# EAGLE schematic Power_Input (EAGLE 9.6.2)
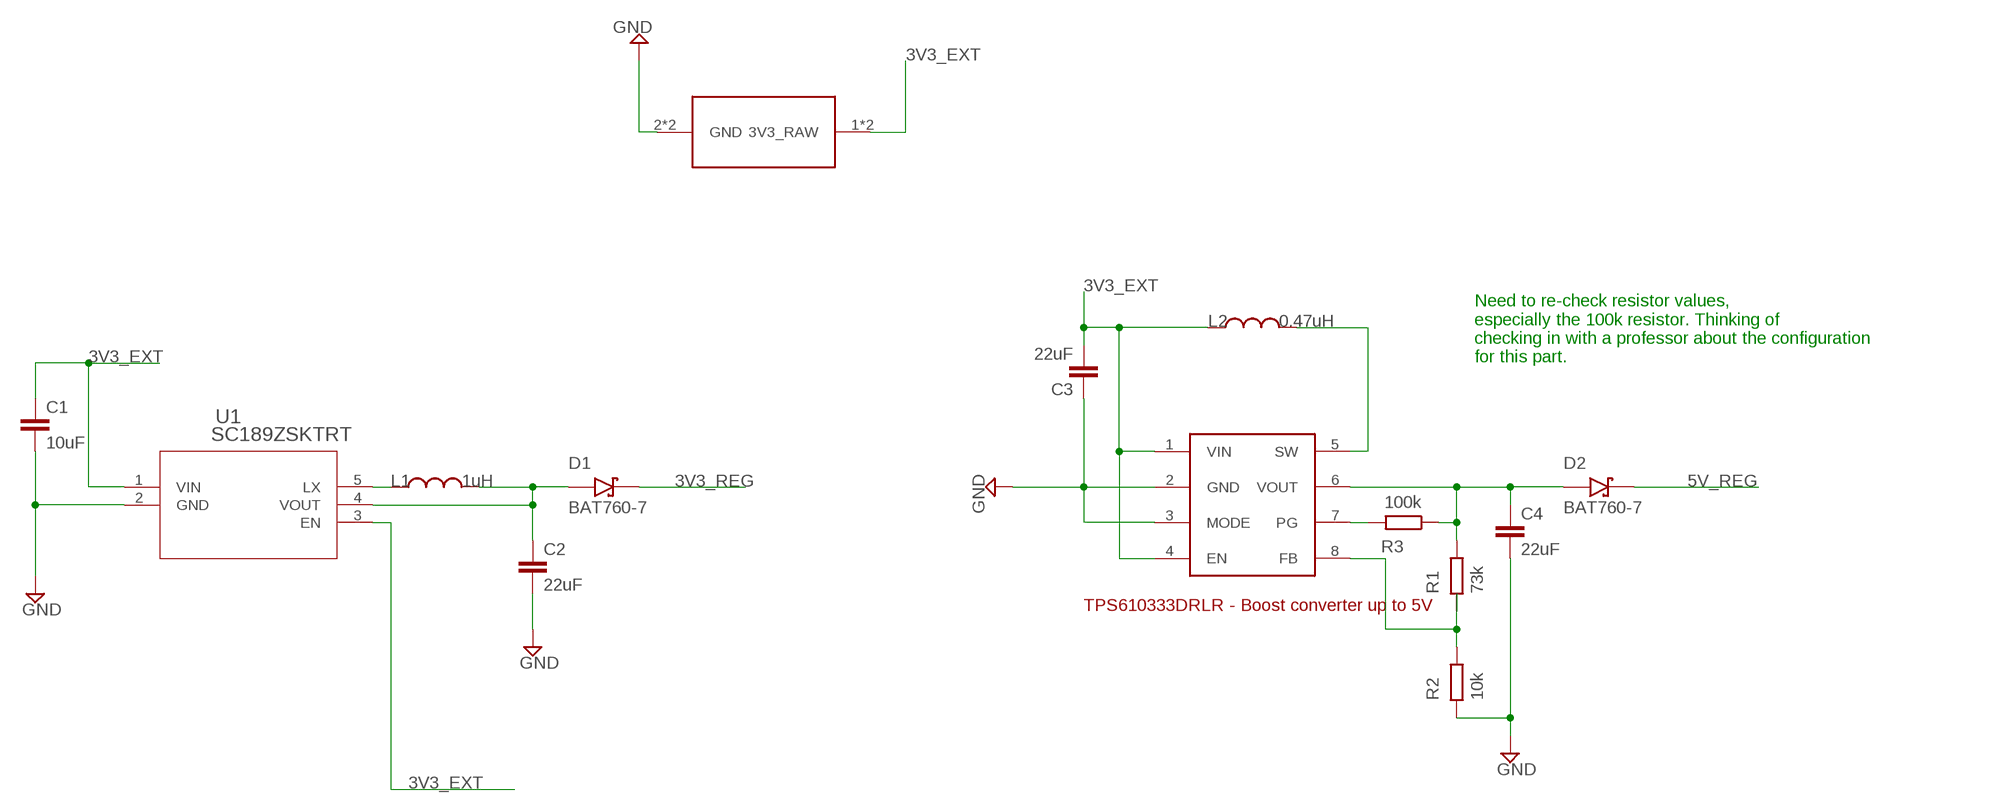
[diagram p0: schematic, sheet 1]

## Parts
C1  10uF  C2,5-3  [C2.5-3]
C2  22uF  C2,5-3  [C2.5-3]
C3  22uF  C2,5-3  [C2.5-3]
C4  22uF  C2,5-3  [C2.5-3]
D1  BAT760-7  [SOD2513X120N]
D2  BAT760-7  [SOD2513X120N]
L1  1uH  L  (no package)
L2  0.47uH  L  (no package)
R1  73k  R  (no package)
R2  10k  R  (no package)
R3  100k  R  (no package)
U1  SC189ZSKTRT  [SOT23-5-SC189_SEM]
U$1  POWER_CONN  [POWER_CONN]
U$2  TPS610333DRLR  [TPS610333DRLR]

## Nets
3V3_EXT: C1.1 U1.1(VIN) U1.3(EN) U$1.1(3V3_RAW) U$1.3(3V3_RAW)
3V3_REG: C2.1 D1.A L1.2 U1.4(VOUT)
5V_REG: C4.1 D2.A R1.2 R3.1 U$2.6(VOUT)
GND: C1.2 C2.2 C3.1 C4.2 R2.1 U1.2(GND) U$1.2(GND) U$1.4(GND) U$2.2(GND) U$2.3(MODE)
N$1: L1.1 U1.5(LX)
N$2: L2.2 U$2.5(SW)
N$3: R1.1 R2.2 U$2.8(FB)
N$4: D1.C(K)
N$5: R3.2 U$2.7(PG)
N$6: D2.C(K)
N$9: C3.2 L2.1 U$2.1(VIN) U$2.4(EN)

## Notes on the sheet
- Need to re-check resistor values, 
  especially the 100k resistor. Thinking of
  checking in with a professor about the configuration
  for this part.

## Library data of the parts
C1-C4 = capacitor-wima:C: CAPACITOR naming: grid - package width
D1 D2 = BAT760-7:BAT760-7: Diode Schottky 30V 1A Surface Mount SOD-323; MANUFACTURER: DIODES; MAXIMUM_PACKAGE_HEIGHT: 1.20mm; PARTREV: 9-2; STANDARD: IPC-7351B
L1 L2 = ngspice-simulation:L: INDUCTOR
R1-R3 = ngspice-simulation:R: RESISTOR
U1 = SC189ZSKTRT_3V3:SC189ZSKTRT; COPYRIGHT: Copyright (C) 2024 Ultra Librarian. All rights reserved.; MANUFACTURER_PART_NUMBER: SC189ZSKTRT; MFR_NAME: Semtech
U$1 = PWR_IN:POWER_CONN: Power connection for our external power. The ground and voltage-in have two different sized holes available to give the power team flexibility in whatever battery casing they decide.
U$2 = TPS610333DRLR:TPS610333DRLR: TPS610333DRLR is a linear boost converter that takes an input of 3V-4.35V and outputs 5V